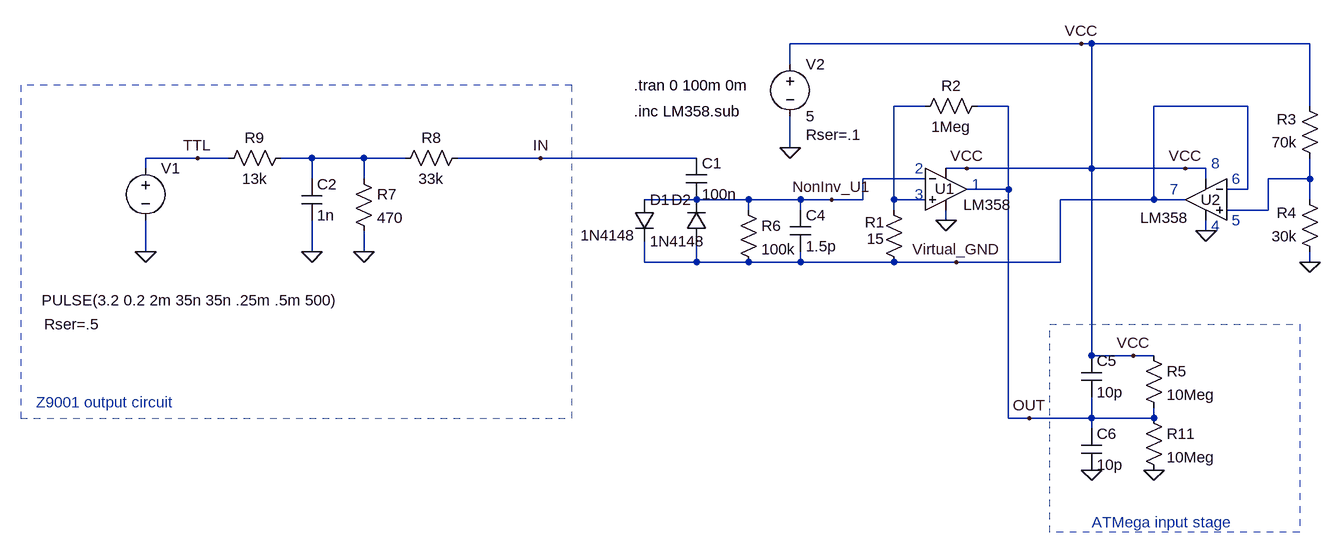
[diagram p0: schematic Cass2SD_AnalogStage.asc]
Cass2SD_AnalogStage.asc, the LTspice schematic file:
Version 4
SHEET 1 880 680
WIRE 224 -432 -224 -432
WIRE 240 -432 224 -432
WIRE 576 -432 240 -432
WIRE -224 -400 -224 -432
WIRE -16 -336 -64 -336
WIRE 112 -336 64 -336
WIRE 480 -336 336 -336
WIRE 576 -336 576 -432
WIRE -224 -272 -224 -320
WIRE -1136 -256 -1216 -256
WIRE -1088 -256 -1136 -256
WIRE -960 -256 -1008 -256
WIRE -880 -256 -960 -256
WIRE -816 -256 -880 -256
WIRE -608 -256 -736 -256
WIRE -368 -256 -608 -256
WIRE -1216 -240 -1216 -256
WIRE 48 -240 16 -240
WIRE 240 -240 240 -432
WIRE 240 -240 48 -240
WIRE 384 -240 240 -240
WIRE 416 -240 384 -240
WIRE -960 -224 -960 -256
WIRE -880 -224 -880 -256
WIRE -16 -224 -112 -224
WIRE 416 -224 416 -240
WIRE 576 -224 576 -256
WIRE 576 -224 512 -224
WIRE 112 -208 112 -336
WIRE 112 -208 48 -208
WIRE 480 -208 480 -336
WIRE 480 -208 448 -208
WIRE -368 -192 -448 -192
WIRE -288 -192 -368 -192
WIRE -208 -192 -288 -192
WIRE -160 -192 -208 -192
WIRE -112 -192 -112 -224
WIRE -112 -192 -160 -192
WIRE -64 -192 -64 -336
WIRE -16 -192 -64 -192
WIRE 336 -192 336 -336
WIRE 336 -192 192 -192
WIRE 384 -192 336 -192
WIRE 576 -192 576 -224
WIRE -288 -176 -288 -192
WIRE -208 -176 -208 -192
WIRE -64 -176 -64 -192
WIRE 512 -176 512 -224
WIRE 512 -176 448 -176
WIRE 16 -160 16 -176
WIRE 416 -144 416 -160
WIRE -1216 -112 -1216 -160
WIRE -960 -112 -960 -160
WIRE -880 -112 -880 -144
WIRE -448 -96 -448 -128
WIRE -368 -96 -368 -128
WIRE -368 -96 -448 -96
WIRE -288 -96 -368 -96
WIRE -208 -96 -208 -112
WIRE -208 -96 -288 -96
WIRE -64 -96 -208 -96
WIRE 32 -96 -64 -96
WIRE 192 -96 192 -192
WIRE 192 -96 32 -96
WIRE 576 -96 576 -112
WIRE 240 48 240 -240
WIRE 304 48 240 48
WIRE 336 48 304 48
WIRE 112 144 112 -208
WIRE 144 144 112 144
WIRE 240 144 240 112
WIRE 240 144 144 144
WIRE 336 144 336 128
WIRE 336 144 240 144
WIRE 240 160 240 144
FLAG -224 -272 0
FLAG -1216 -112 0
FLAG 416 -144 0
FLAG 16 -160 0
FLAG 576 -96 0
FLAG 144 144 OUT
FLAG -608 -256 IN
FLAG -160 -192 NonInv_U1
FLAG -880 -112 0
FLAG -960 -112 0
FLAG -1136 -256 TTL
FLAG 32 -96 Virtual_GND
FLAG 336 224 0
FLAG 240 224 0
FLAG 224 -432 VCC
FLAG 48 -240 VCC
FLAG 384 -240 VCC
FLAG 304 48 VCC
SYMBOL voltage -1216 -256 R0
WINDOW 123 0 0 Left 2
WINDOW 39 -156 256 Left 2
WINDOW 3 -160 219 Left 2
SYMATTR SpiceLine Rser=.5
SYMATTR Value PULSE(3.2 0.2 2m 35n 35n .25m .5m 500)
SYMATTR InstName V1
SYMBOL voltage -224 -416 R0
WINDOW 123 0 0 Left 2
WINDOW 39 24 124 Left 2
SYMATTR SpiceLine Rser=.1
SYMATTR InstName V2
SYMATTR Value 5
SYMBOL Opamps\\UniversalOpamp2 16 -208 R0
WINDOW 38 27 24 Left 2
WINDOW 0 -17 -1 Left 2
SYMATTR SpiceModel LM358
SYMATTR InstName U1
SYMATTR Value2 ""
SYMATTR SpiceLine ""
SYMATTR SpiceLine2 ""
SYMBOL diode -464 -192 R0
SYMATTR InstName D1
SYMATTR Value 1N4148
SYMBOL diode -352 -128 R180
WINDOW 0 24 64 Left 2
WINDOW 3 110 9 Left 2
SYMATTR InstName D2
SYMATTR Value 1N4148
SYMBOL res -80 -192 R0
WINDOW 0 -29 35 Left 2
WINDOW 3 -26 60 Left 2
SYMATTR InstName R1
SYMATTR Value 15
SYMBOL res 80 -352 R90
WINDOW 0 0 56 VBottom 2
WINDOW 3 32 56 VTop 2
SYMATTR InstName R2
SYMATTR Value 1Meg
SYMBOL res 592 -240 R180
WINDOW 0 36 76 Left 2
WINDOW 3 36 40 Left 2
SYMATTR InstName R3
SYMATTR Value 70k
SYMBOL res 592 -96 R180
WINDOW 0 36 76 Left 2
WINDOW 3 36 40 Left 2
SYMATTR InstName R4
SYMATTR Value 30k
SYMBOL Opamps\\UniversalOpamp2 416 -192 M0
WINDOW 38 27 28 Left 2
WINDOW 0 -23 0 Left 2
SYMATTR SpiceModel LM358
SYMATTR InstName U2
SYMATTR Value2 ""
SYMATTR SpiceLine ""
SYMATTR SpiceLine2 ""
SYMBOL cap -384 -256 R0
SYMATTR InstName C1
SYMATTR Value 100n
SYMBOL res -304 -192 R0
SYMATTR InstName R6
SYMATTR Value 100k
SYMBOL res -896 -240 R0
SYMATTR InstName R7
SYMATTR Value 470
SYMBOL res -720 -272 R90
WINDOW 0 0 56 VBottom 2
WINDOW 3 32 56 VTop 2
SYMATTR InstName R8
SYMATTR Value 33k
SYMBOL cap -976 -224 R0
SYMATTR InstName C2
SYMATTR Value 1n
SYMBOL res -992 -272 R90
WINDOW 0 0 56 VBottom 2
WINDOW 3 32 56 VTop 2
SYMATTR InstName R9
SYMATTR Value 13k
SYMBOL cap -224 -176 R0
SYMATTR InstName C4
SYMATTR Value 1.5p
SYMBOL cap 224 48 R0
SYMATTR InstName C5
SYMATTR Value 10p
SYMBOL cap 224 160 R0
SYMATTR InstName C6
SYMATTR Value 10p
SYMBOL res 320 32 R0
SYMATTR InstName R5
SYMATTR Value 10Meg
SYMBOL res 320 128 R0
SYMATTR InstName R11
SYMATTR Value 10Meg
TEXT -464 -368 Left 2 !.tran 0 100m 0m
TEXT -464 -328 Left 2 !.inc LM358.sub
TEXT -1384 120 Left 2 ;Z9001 output circuit
TEXT 56 -216 Left 2 ;1
TEXT -32 -240 Left 2 ;2
TEXT -32 -200 Left 2 ;3
TEXT 456 -160 Left 2 ;5
TEXT 456 -224 Left 2 ;6
TEXT 360 -208 Left 2 ;7
TEXT 424 -248 Left 2 ;8
TEXT 424 -152 Left 2 ;4
TEXT 240 304 Left 2 ;ATMega input stage
RECTANGLE Normal 176 0 560 320 2
RECTANGLE Normal -1408 144 -560 -368 2

The netlist it stands for:
* Cass2SD_AnalogStage.asc
V1 TTL 0 PULSE(3.2 0.2 2m 35n 35n .25m .5m 500) Rser=.5
V2 VCC 0 5 Rser=.1
XU1 N001 NonInv_U1 VCC 0 OUT LM358  ; pins IN+ IN- V+ V- OUT
D1 NonInv_U1 Virtual_GND 1N4148
D2 Virtual_GND NonInv_U1 1N4148
R1 N001 Virtual_GND 15
R2 OUT N001 1Meg
R3 N003 VCC 70k
R4 0 N003 30k
XU2 N003 Virtual_GND VCC 0 Virtual_GND LM358  ; pins IN+ IN- V+ V- OUT
C1 IN NonInv_U1 100n
R6 NonInv_U1 Virtual_GND 100k
R7 N002 0 470
R8 IN N002 33k
C2 N002 0 1n
R9 N002 TTL 13k
C4 NonInv_U1 Virtual_GND 1.5p
C5 VCC OUT 10p
C6 OUT 0 10p
R5 VCC OUT 10Meg
R11 OUT 0 10Meg
.model D D
.lib standard.dio
.tran 0 100m 0m
.inc LM358.sub
* Z9001 output circuit
* 1
* 2
* 3
* 5
* 6
* 7
* 8
* 4
* ATMega input stage
.lib UniversalOpamps2.sub
.backanno
.end